# Altium schematic sheet DRV.SchDoc
size A4
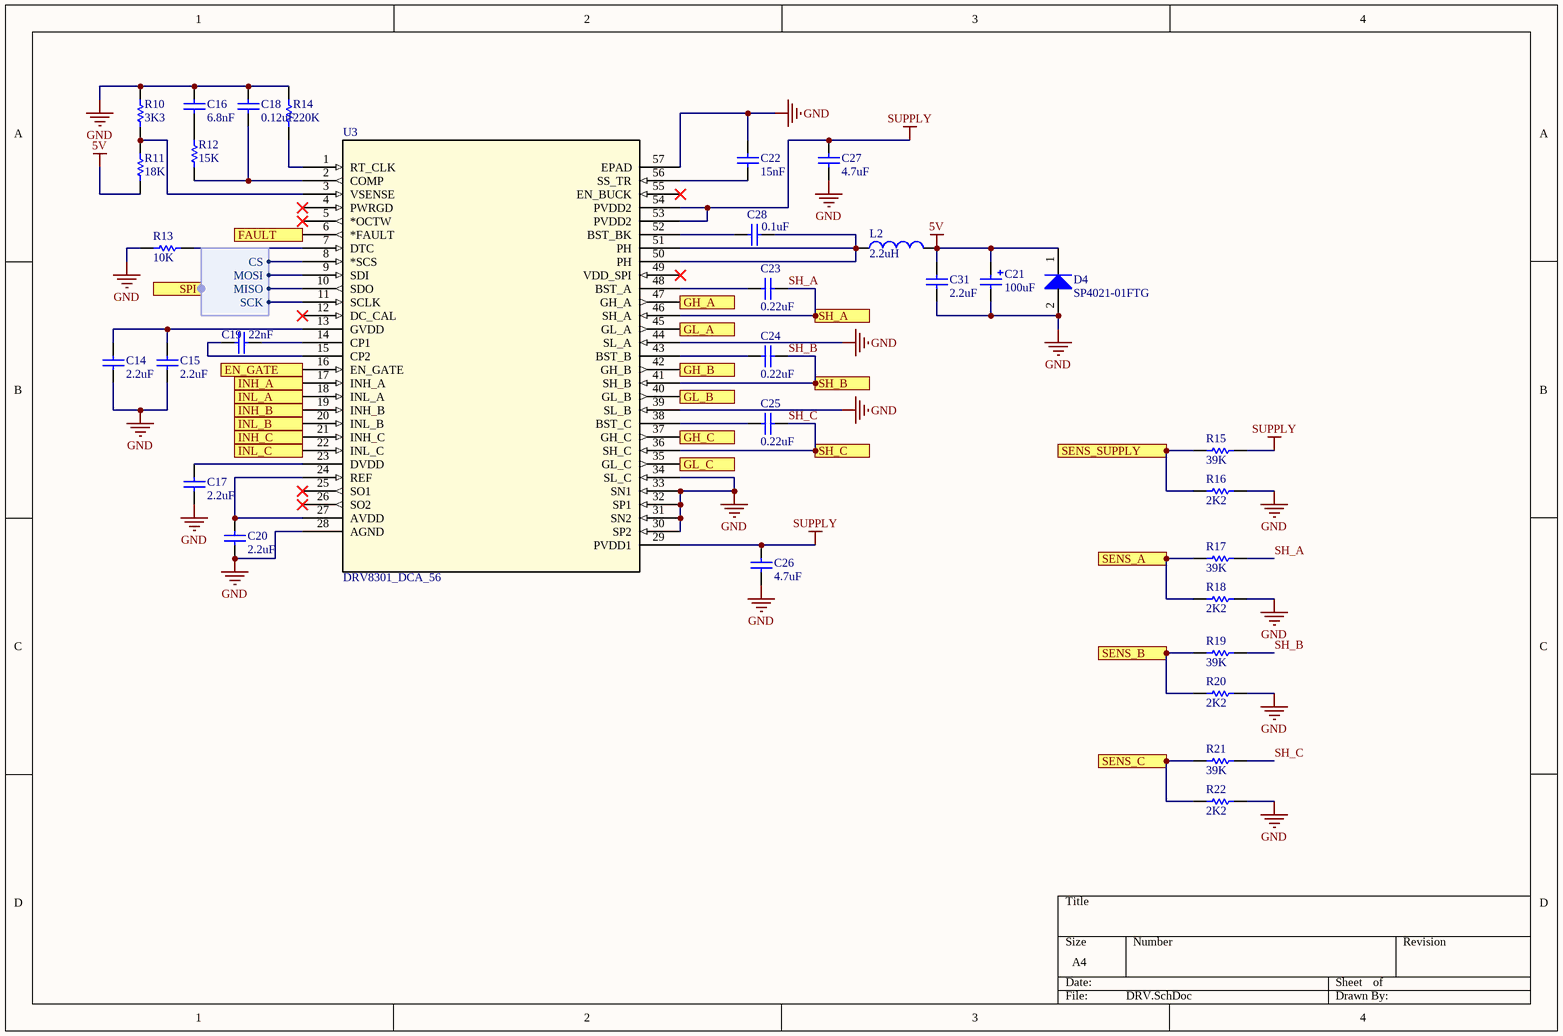
[diagram p0: DRV.SchDoc]

## Parts
C14  value 2.2uF  [C0603[1608X92]]  (hidden comment: 2.2uF 25V 0603)
C15  value 2.2uF  [C0603[1608X92]]  (hidden comment: 2.2uF 25V 0603)
C16  value 6.8nF  [C0603[1608X92]]  (hidden comment: 6.8nF 50V 0603)
C17  value 2.2uF  [C0603[1608X92]]  (hidden comment: 2.2uF 25V 0603)
C18  value 0.12uF  [C0603[1608X92]]  (hidden comment: 0.12uF 10V 0603)
C19  value 22nF  [C0603[1608X92]]  (hidden comment: 22nF 50V 0603)
C20  value 2.2uF  [C0603[1608X92]]  (hidden comment: 2.2uF 25V 0603)
C21  value 100uF  [C1206[3216X105]_Tantal]  (hidden comment: 100uF 16V 1206)
C22  value 15nF  [C0603[1608X92]]  (hidden comment: 15nF 50V 0603)
C23  value 0.22uF  [C0603[1608X92]]  (hidden comment: 0.22uF 50V 0603)
C24  value 0.22uF  [C0603[1608X92]]  (hidden comment: 0.22uF 50V 0603)
C25  value 0.22uF  [C0603[1608X92]]  (hidden comment: 0.22uF 50V 0603)
C26  value 4.7uF  [C1210[3225X200]]  (hidden comment: 4.7uF 100V 1210)
C27  value 4.7uF  [C1210[3225X200]]  (hidden comment: 4.7uF 100V 1210)
C28  value 0.1uF  [C0603[1608X92]]  (hidden comment: 0.1uF 50V 0603)
C31  value 2.2uF  [C1206[3216X160]]  (hidden comment: 2.2uF 6.3V 1206)
D4  SP4021-01FTG  [SOD-323]
L2  value 2.2uH  [XAL8080]  (hidden comment: XAL8080-220ME_)
R10  value 3K3  [R0603[1608]]  (hidden comment: 4K7 1% 0603)
R11  value 18K  [R0603[1608]]  (hidden comment: 18K 1% 0603)
R12  value 15K  [R0603[1608]]  (hidden comment: 15K 1% 0603)
R13  value 10K  [R0603[1608]]  (hidden comment: 10K 1% 0603)
R14  value 220K  [R0603[1608]]  (hidden comment: 220K 1% 0603)
R15  value 39K  [R0603[1608]]  (hidden comment: 39K 1% 0603)
R16  value 2K2  [R0603[1608]]  (hidden comment: 2K2 1% 0603)
R17  value 39K  [R0603[1608]]  (hidden comment: 39K 1% 0603)
R18  value 2K2  [R0603[1608]]  (hidden comment: 2K2 1% 0603)
R19  value 39K  [R0603[1608]]  (hidden comment: 39K 1% 0603)
R20  value 2K2  [R0603[1608]]  (hidden comment: 2K2 1% 0603)
R21  value 39K  [R0603[1608]]  (hidden comment: 39K 1% 0603)
R22  value 2K2  [R0603[1608]]  (hidden comment: 2K2 1% 0603)
U3  DRV8301_DCA_56  [DCA56_6P35X3P61]

## Ports
EN_GATE (in), FAULT (out), GH_A (out), GH_B (out), GH_C (out), GL_A (out), GL_B (out), GL_C (out), INH_A (in), INH_B (in), INH_C (in), INL_A (in), INL_B (in), INL_C (in), SENS_A (out), SENS_B (out), SENS_C (out), SENS_SUPPLY (out), SH_A (in), SH_B (in), SH_C (in), SPI (harness SPI)

## Harnesses
SPI: SCK, MOSI, MISO, CS

## Nets
5V: C21.1 C31.1 D4.1(K) L2.2 R11.1
GND: C14.1 C15.1 C16.2 C17.1 C18.2 C20.1 C21.2 C22.2 C26.1 C27.2 C31.2 D4.2(A) R10.2 R13.1 R14.2 R16.2 R18.2 R20.2 R22.2 U3.28(AGND) U3.30(SP2) U3.31(SN2) U3.32(SP1) U3.33(SN1) U3.34(SL_C) U3.39(SL_B) U3.44(SL_A) U3.57(EPAD)
SUPPLY: C26.2 C27.1 R15.2 U3.29(PVDD1) U3.53(PVDD2) U3.54(PVDD2)
EN_GATE: U3.16(EN_GATE) ; port EN_GATE
FAULT: U3.6(*FAULT) ; port FAULT
GH_A: U3.47(GH_A) ; port GH_A
GH_B: U3.42(GH_B) ; port GH_B
GH_C: U3.37(GH_C) ; port GH_C
GL_A: U3.45(GL_A) ; port GL_A
GL_B: U3.40(GL_B) ; port GL_B
GL_C: U3.35(GL_C) ; port GL_C
INH_A: U3.17(INH_A) ; port INH_A
INH_B: U3.19(INH_B) ; port INH_B
INH_C: U3.21(INH_C) ; port INH_C
INL_A: U3.18(INL_A) ; port INL_A
INL_B: U3.20(INL_B) ; port INL_B
INL_C: U3.22(INL_C) ; port INL_C
SENS_A: R17.1 R18.1 ; port SENS_A
SENS_B: R19.1 R20.1 ; port SENS_B
SENS_C: R21.1 R22.1 ; port SENS_C
SENS_SUPPLY: R15.1 R16.1 ; port SENS_SUPPLY
SH_A: C23.2 R17.2 U3.46(SH_A) ; port SH_A
SH_B: C24.2 R19.2 U3.41(SH_B) ; port SH_B
SH_C: C25.2 R21.2 U3.36(SH_C) ; port SH_C
NetC14_2: C14.2 C15.2 U3.13(GVDD)
NetC16_1: C16.1 R12.2
NetC17_2: C17.2 U3.23(DVDD)
NetC18_1: C18.1 R12.1 U3.2(COMP)
NetC19_1: C19.1 U3.14(CP1)
NetC19_2: C19.2 U3.15(CP2)
NetC20_2: C20.2 U3.24(REF) U3.27(AVDD)
NetC22_1: C22.1 U3.56(SS_TR)
NetC23_1: C23.1 U3.48(BST_A)
NetC24_1: C24.1 U3.43(BST_B)
NetC25_1: C25.1 U3.38(BST_C)
NetC28_1: C28.1 L2.1 U3.50(PH) U3.51(PH)
NetC28_2: C28.2 U3.52(BST_BK)
NetR10_1: R10.1 R11.2 U3.3(VSENSE)
NetR13_2: R13.2 U3.7(DTC)
NetR14_1: R14.1 U3.1(RT_CLK)
NetU3_8: U3.8(*SCS) ; port SPI.CS
NetU3_9: U3.9(SDI) ; port SPI.MOSI
NetU3_10: U3.10(SDO) ; port SPI.MISO
NetU3_11: U3.11(SCLK) ; port SPI.SCK

Not connected (* = marked no-connect by the designer): U3 4(PWRGD)* 5(*OCTW)* 12(DC_CAL)* 25(SO1)* 26(SO2)* 49(VDD_SPI)* 55(EN_BUCK)*

## Library data of the parts
C14 C15 C17 C20 = CAP_2.2uF_25V_0603_10%: 2.2uF 25V 10% 0603 (1608 Metric); PartNumber: GRM188R61E225KA12D; Manufacturer: Murata; TemperatureCoefficient: X5R; Mounting Technology: Surface Mount; PackageReference: 0603; PackageDescription: 0603 (1608 Metric); Voltage: 25V; Tolerance: 10%
C16 = CAP_6.8nF_50V_0603_5%: 6.8nF 50V 5% 0603 (1608 Metric); PartNumber: GRM1885C1H682JA01D; Manufacturer: Murata; TemperatureCoefficient: C0G; Mounting Technology: Surface Mount; PackageReference: 0603; PackageDescription: 0603 (1608 Metric); Voltage: 50V; Tolerance: 5%
C18 = CAP_0.12uF_10V_0603_10%: 0.12uF 10V 10% 0603 (1608 Metric); PartNumber: GRM188R71A124KA01D; Manufacturer: Murata; TemperatureCoefficient: X7R; Mounting Technology: Surface Mount; PackageReference: 0603; PackageDescription: 0603 (1608 Metric); Voltage: 10V; Tolerance: 10%
C19 = CAP_22nF_50V_0603_10%: 22nF 50V 10% 0603 (1608 Metric); PartNumber: GRM188R71H223KA01D; Manufacturer: Murata; TemperatureCoefficient: X7R; Mounting Technology: Surface Mount; PackageReference: 0603; PackageDescription: 0603 (1608 Metric); Voltage: 50V; Tolerance: 10%
C21 = CAP_100uF_16V_1206_20%: TANTAL 100uF 16V 20% 1206 (3216 Metric); PartNumber: F931C107MCCAJ6; Manufacturer: AVX Corporation; Mounting Technology: Surface Mount; PackageReference: 1206; PackageDescription: 1206 (3216 Metric); Voltage: 16V; Tolerance: 20%
C22 = CAP_15nF_50V_0603_5%: 15nF 50V 5% 0603 (1608 Metric); PartNumber: GRM188R71H153JA01D; Manufacturer: Murata; TemperatureCoefficient: X7R; Mounting Technology: Surface Mount; PackageReference: 0603; PackageDescription: 0603 (1608 Metric); Voltage: 50V; Tolerance: 5%
C23-C25 = CAP_0.22uF_50V_0603_10%: 0.22uF 50V 10% 0603 (1608 Metric); PartNumber: GRM188R61H224KAC4D; Manufacturer: Murata; TemperatureCoefficient: X7R; Mounting Technology: Surface Mount; PackageReference: 0603; PackageDescription: 0603 (1608 Metric); Voltage: 50V; Tolerance: 10%
C26 C27 = CAP_4.7uF_100V_1210_10%: 4.7uF 100V 10% 1210 (3225 Metric); PartNumber: GRJ32DC72A475KE11L; Manufacturer: Murata; Mounting Technology: Surface Mount; PackageReference: 1210; PackageDescription: 1210 (3225 Metric); Voltage: 100V; Tolerance: 10%
C28 = CAP_0.1uF_50V_0603_10%: 0.1uF 50V 10% 0603 (1608 Metric); PartNumber: GCM188R71H104KA57D; Manufacturer: Murata; TemperatureCoefficient: X7R; Mounting Technology: Surface Mount; PackageReference: 0603; PackageDescription: 0603 (1608 Metric); Voltage: 50V; Tolerance: 10%
C31 = CAP_2.2uF_16V_1206_10%: 2.2uF 6.3V 10% 1206 (3216 Metric); PartNumber: GRM31CR60J476KE19L; Manufacturer: Murata; Voltage: 16V; Mounting Technology: Surface Mount; PackageReference: 1206; PackageDescription: 1206 (3216 Metric); Tolerance: 10%
D4 = SP4021-01FTG: Manufacturer: Littelfuse; PartNumber: SP4021-01FTG; PackageReference: SOD-323-2; Mounting Technology: Surface Mount
L2 = XAL8080-220ME_: 2.2uH 38A 4.08mOhms; PartNumber: XAL8080-270MED; Manufacturer: Coilcraft; Published: 8-Jun-2000; PackageReference: 0402-A; Publisher: Altium Limited; PackageDescription: Chip Inductor
R10 = RES_3K3_0603_1%: 3K3 0.25W 1% 0603 (1005 Metric); Manufacturer: Vishay / Dale; PartNumber: CRCW06033K30FKEAHP; Tolerance: 1%; Power: 0.25W; Mounting Technology: Surface Mount; PackageReference: 0603; PackageDescription: 0603 (1608 Metric); ComponentLink1Description: Datasheet; ComponentLink1URL: http://www.vishay.com/docs/20043/crcwhpe3.pdf
R11 = RES_18K_0603_1%: 18K 0.25W 1% 0603 (1005 Metric); Manufacturer: Vishay / Dale; PartNumber: CRCW060318K0FKEAHP; Tolerance: 1%; Power: 0.25W; Mounting Technology: Surface Mount; PackageReference: 0603; PackageDescription: 0603 (1608 Metric); ComponentLink1Description: Datasheet; ComponentLink1URL: http://www.vishay.com/docs/20043/crcwhpe3.pdf
R12 = RES_15K_0603_1%: 15K 0.25W 1% 0603 (1005 Metric); Manufacturer: Vishay / Dale; PartNumber: CRCW060315K0FKEAHP; Tolerance: 1%; Power: 0.25W; Mounting Technology: Surface Mount; PackageReference: 0603; PackageDescription: 0603 (1608 Metric); ComponentLink1Description: Datasheet; ComponentLink1URL: http://www.vishay.com/docs/20043/crcwhpe3.pdf
R13 = RES_10K_0603_1%: 10K 0.25W 1% 0603 (1005 Metric); Manufacturer: Vishay; PartNumber: RCS060310K0FKEA; Tolerance: 1%; Power: 0.25W; Mounting Technology: Surface Mount; PackageReference: 0603; PackageDescription: 0603 (1608 Metric); ComponentLink1Description: Datasheet; ComponentLink1URL: http://www.vishay.com/docs/20065/rcse3.pdf
R14 = RES_220K_0603_1%: 220K 0.25W 1% 0603 (1005 Metric); Manufacturer: Vishay / Dale; PartNumber: CRCW0603220KJNEAHP; Tolerance: 1%; Power: 0.25W; Mounting Technology: Surface Mount; PackageReference: 0603; PackageDescription: 0603 (1608 Metric); ComponentLink1Description: Datasheet; ComponentLink1URL: http://www.vishay.com/docs/20043/crcwhpe3.pdf
R15 R17 R19 R21 = RES_39K_0603_1%: 39K 0.25W 1% 0603 (1005 Metric); Manufacturer: Vishay / Dale; PartNumber: CRCW060339K0FKEAHP; Tolerance: 1%; Power: 0.25W; Mounting Technology: Surface Mount; PackageReference: 0603; PackageDescription: 0603 (1608 Metric); ComponentLink1Description: Datasheet; ComponentLink1URL: http://www.vishay.com/docs/20043/crcwhpe3.pdf
R16 R18 R20 R22 = RES_2K2_0603_1%: 2K2 0.25W 1% 0603 (1005 Metric); Manufacturer: Vishay / Dale; PartNumber: CRCW06032K20FKEAHP; Tolerance: 1%; Power: 0.25W; Mounting Technology: Surface Mount; PackageReference: 0603; PackageDescription: 0603 (1608 Metric); ComponentLink1Description: Datasheet; ComponentLink1URL: http://www.vishay.com/docs/20043/crcwhpe3.pdf
U3 = DRV8301_DCA_56: Imported; Manufacturer: Texas Instruments; FAMILY_NAME: 3-PHASE BRUSHLESS PRE-DRIVER; PIN_COUNT: 56; PACKAGE_DESIGNATOR: DCA; Datasheet_URL: http://www.ti.com/lit/gpn/DRV8301; GENERIC_PART_NUMBER: DRV8301; Vendor: Texas Instruments; Value: Value; Type: Type; RefDes: RefDes; PackageReference: HTSSOP; PartNumber: DRV8301_DCA